# EasyEDA Pro project 原理图.eprj

# Schematic Schematic1
Create Date: 2024-08-26; Page Name: P1; Project Name: 原理图; Schematic Name: Schematic1; Update Date: 2024-08-26; Add into BOM: yes; Company: 嘉立创EDA; Convert to PCB: yes; Page Size: A4; Version: V1.0
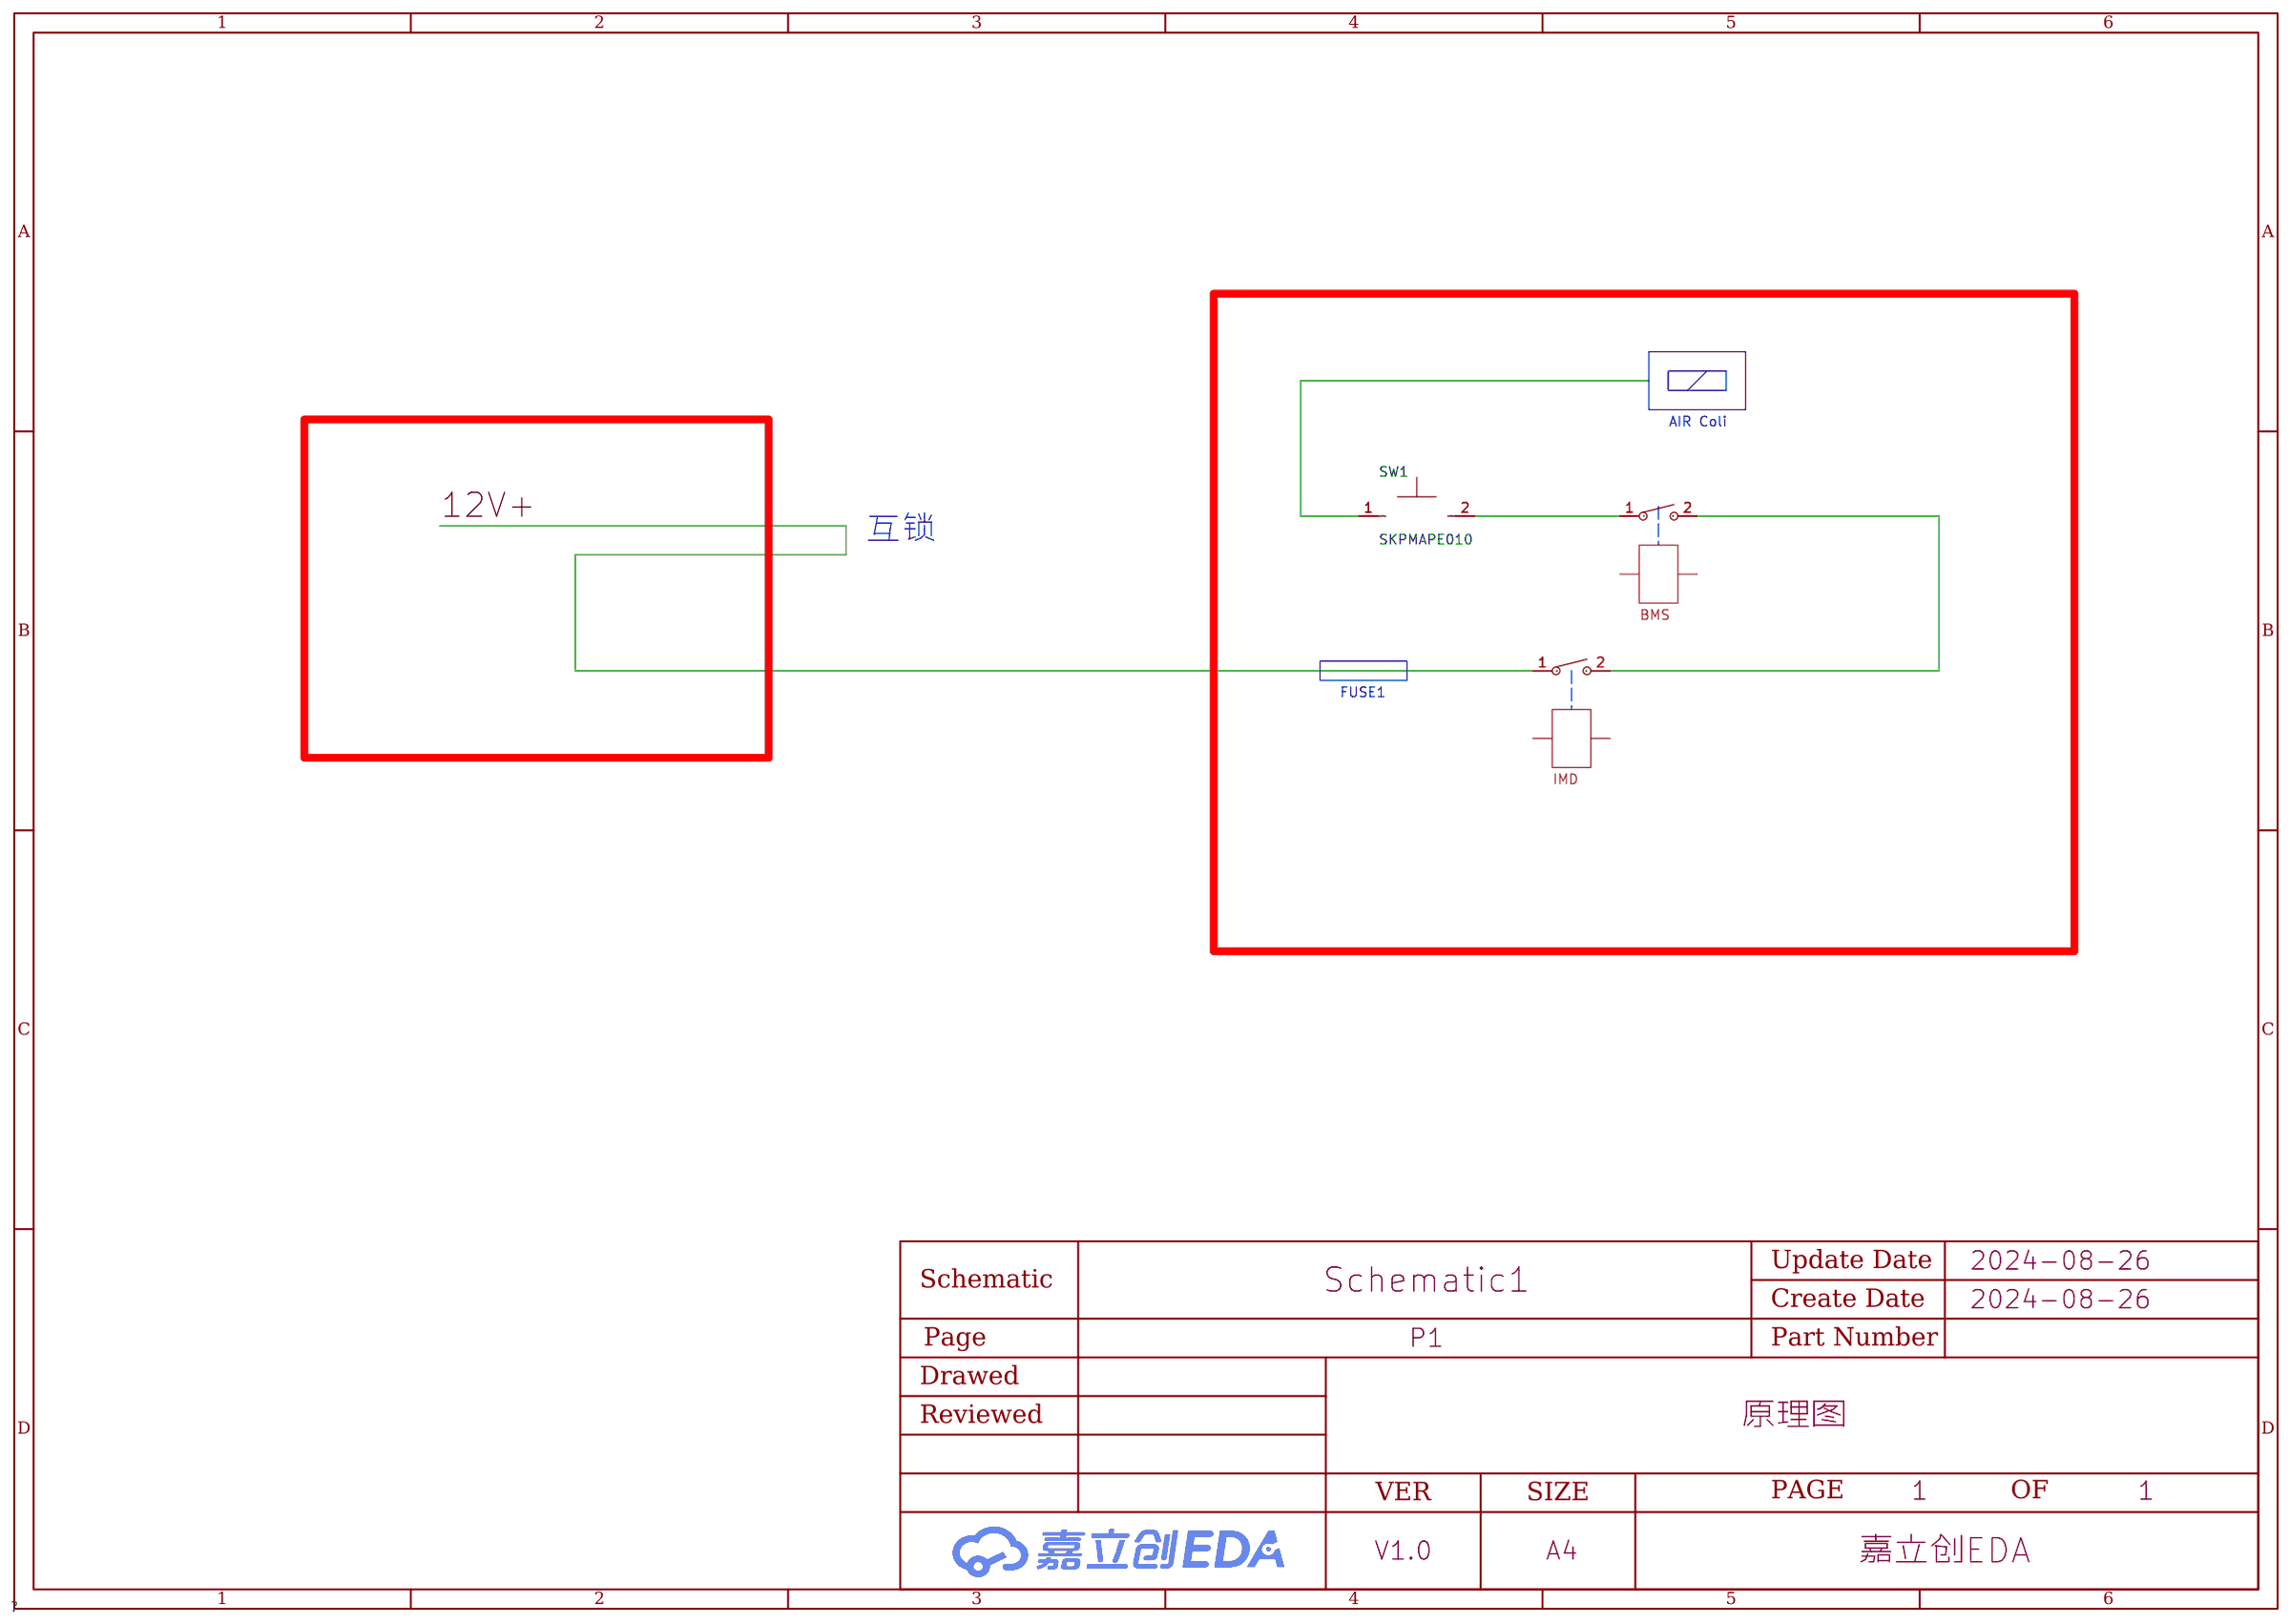
[diagram p0: schematic sheet]

## Parts
SW1  SKPMAPE010  [KEY-SMD_2P-L6.0-W6.0-P6.00]
SW?#1  K2-1822SA-A3DW-06  [KEY-SMD_K2-1822SA-A3DW-06]
SW?#2  K2-1822SA-A3DW-06  [KEY-SMD_K2-1822SA-A3DW-06]

## Library data of the parts
SW1 = SKPMAPE010: 触点电流:50mA;额定电压(DC):16V;电路结构:单刀单掷;安装方式:立贴;按钮形状:圆形按钮;带灯:-;开关长度:6mm;开关宽度:5.9mm;开关高度:5mm;; Supplier Part: C110292; Manufacturer: ALPSALPINE(阿尔卑斯阿尔派); Supplier Footprint: SMD; JLCPCB Part Class: Extended Part; Datasheet: https://atta.szlcsc.com/upload/public/pdf/source/20170428/1493376812340.pdf; Supplier: LCSC; Contact Current: 50mA; Voltage Rating (DC): 16V; Circuit: 单刀单掷; Mounting Style: 立贴; Actuator Style: 圆形按钮; Switch Length: 6mm; Switch Width: 5.9mm; Switch Height: 5mm
SW?#1 SW?#2 = K2-1822SA-A3DW-06: 触点电流:50mA;额定电压(DC):12V;绝缘电阻:100MΩ;电路结构:单刀单掷;安装方式:立贴;按钮形状:圆形按钮;带灯:-;作用力:180gf@±30gf;机械寿命:100000;工作温度:-25℃~+85℃;开关长度:3mm;开关宽度:2.5mm;开关高度:1.5mm;; LCSC Part Name: 小体积开关 3.0mm*2.5mm*1.5mm 带固定柱; Supplier Part: C128937; Manufacturer: 韩国韩荣; Supplier Footprint: SMD; JLCPCB Part Class: Extended Part; Datasheet: https://atta.szlcsc.com/upload/public/pdf/source/20200721/C707340_7963A55611347426827C5B7D7D768B53.pdf; Supplier: LCSC; Contact Current: 50mA; Voltage Rating (DC): 12V; Insulation Resistance: 100MΩ; Circuit: 单刀单掷; Mounting Sytle: 立贴; Actuator Style: 圆形按钮; Operating Force: 180gf@±30gf; Mechanical Life: 100000; Operating Temperature: -25℃~+85℃; Switch Length: 3mm; Switch Width: 2.5mm; Switch Height: 1.5mm

## Nets
12V+: SW?#1.1
Net-(SW1-2): SW1.2 SW?#2.1
Net-(SW?#1-2): SW?#1.2 SW?#2.2

Not connected (* = marked no-connect by the designer): SW1 1

## Notes on the sheet
- AIR Coli
- 互锁
- BMS
- FUSE1
- IMD
